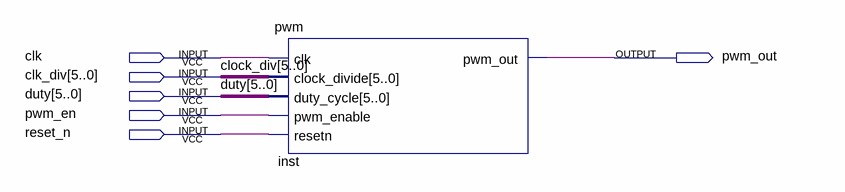
[diagram p0: schematic sheet]
// Quartus schematic pwm1.bdf as structural Verilog: 1 symbols, 6 pins
module pwm1 (
  input  clk,
  input  [5:0] clk_div,
  input  [5:0] duty,
  input  pwm_en,
  input  reset_n,
  output pwm_out
);

  pwm inst (
    .clk(clk), .clock_divide(clk_div), .duty_cycle(duty), .pwm_enable(pwm_en), .resetn(reset_n),
    .pwm_out(pwm_out));

  // Other names for the same wires on the sheet: clock_div[5:0] = clk_div
endmodule
